# EAGLE design main (EAGLE 6.1)
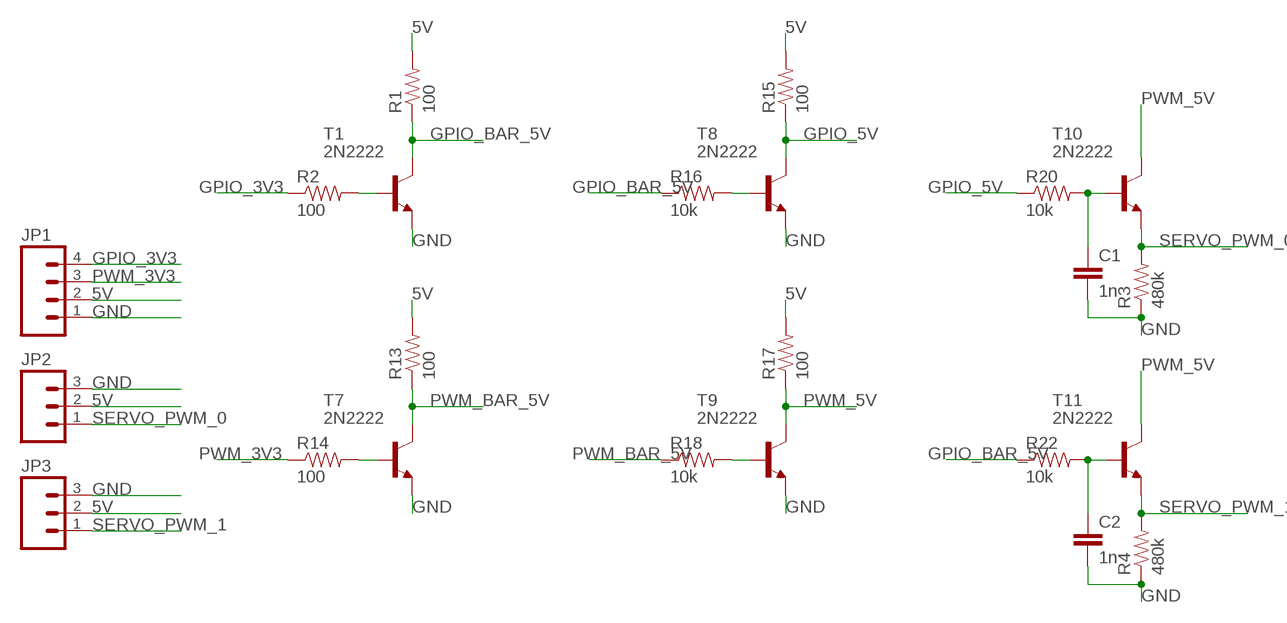
[diagram p0: schematic, sheet 1]

## Parts
C1  1n  CAPKIT  [CAP-PTH-SMALL-KIT]
C2  1n  CAPKIT  [CAP-PTH-SMALL-KIT]
JP1  M04LONGPADS  [1X04_LONGPADS]
JP2  M03LONGPADS  [1X03_LONGPADS]
JP3  M03LONGPADS  [1X03_LONGPADS]
R1  100  RESISTORPTH-1/4W  [AXIAL-0.4]
R2  100  RESISTORPTH-1/4W  [AXIAL-0.4]
R3  480k  RESISTORPTH-1/4W  [AXIAL-0.4]
R4  480k  RESISTORPTH-1/4W  [AXIAL-0.4]
R13  100  RESISTORPTH-1/4W  [AXIAL-0.4]
R14  100  RESISTORPTH-1/4W  [AXIAL-0.4]
R15  100  RESISTORPTH-1/4W  [AXIAL-0.4]
R16  10k  RESISTORPTH-1/4W  [AXIAL-0.4]
R17  100  RESISTORPTH-1/4W  [AXIAL-0.4]
R18  10k  RESISTORPTH-1/4W  [AXIAL-0.4]
R20  10k  RESISTORPTH-1/4W  [AXIAL-0.4]
R22  10k  RESISTORPTH-1/4W  [AXIAL-0.4]
T1  2N2222  [TO18]
T7  2N2222  [TO18]
T8  2N2222  [TO18]
T9  2N2222  [TO18]
T10  2N2222  [TO18]
T11  2N2222  [TO18]

## Nets
5V: JP1.2 JP2.2 JP3.2 R1.P$2 R13.P$2 R15.P$2 R17.P$2
GND: C1.2 C2.2 JP1.1 JP2.3 JP3.3 R3.P$1 R4.P$1 T1.1(E) T7.1(E) T8.1(E) T9.1(E)
GPIO_3V3: JP1.4 R2.P$1
GPIO_5V: R15.P$1 R20.P$1 T8.3(C)
GPIO_BAR_5V: R1.P$1 R16.P$1 R22.P$1 T1.3(C)
N$1: R2.P$2 T1.2(B)
N$2: R14.P$2 T7.2(B)
N$3: R16.P$2 T8.2(B)
N$4: R18.P$2 T9.2(B)
N$5: C1.1 R20.P$2 T10.2(B)
N$6: C2.1 R22.P$2 T11.2(B)
PWM_3V3: JP1.3 R14.P$1
PWM_5V: R17.P$1 T9.3(C) T10.3(C) T11.3(C)
PWM_BAR_5V: R13.P$1 R18.P$1 T7.3(C)
SERVO_PWM_0: JP2.1 R3.P$2 T10.1(E)
SERVO_PWM_1: JP3.1 R4.P$2 T11.1(E)

## Library data of the parts
C1 C2 = SparkFun:CAP: Capacitor Standard 0603 ceramic capacitor, and 0.1" leaded capacitor.
JP1 = SparkFun:M04: Header 4 Standard 4-pin 0.1" header. Use with straight break away headers (SKU : PRT-00116), right angle break away headers (PRT-00553), swiss pins (PRT-00743), machine pins (PRT-00117), and female headers (PRT-00115). Molex polarized connector foot print use with SKU : PRT-08231 with associated crimp pins and housings. 1MM SMD Version SKU: PRT-10208
JP2 JP3 = SparkFun:M03: Header 3 Standard 3-pin 0.1" header. Use with straight break away headers (SKU : PRT-00116), right angle break away headers (PRT-00553), swiss pins (PRT-00743), machine pins (PRT-00117), and female headers (PRT-00115). Molex polarized connector foot print use with SKU : PRT-08232 with associated crimp pins and housings.
R1-R4 R13-R18 R20 R22 = SparkFun:RESISTOR: Resistor Basic schematic elements and footprints for 0603, 1206, and PTH resistors.
T1 T7-T11 = transistor:2N2222: NPN TRANSISTOR

## Board
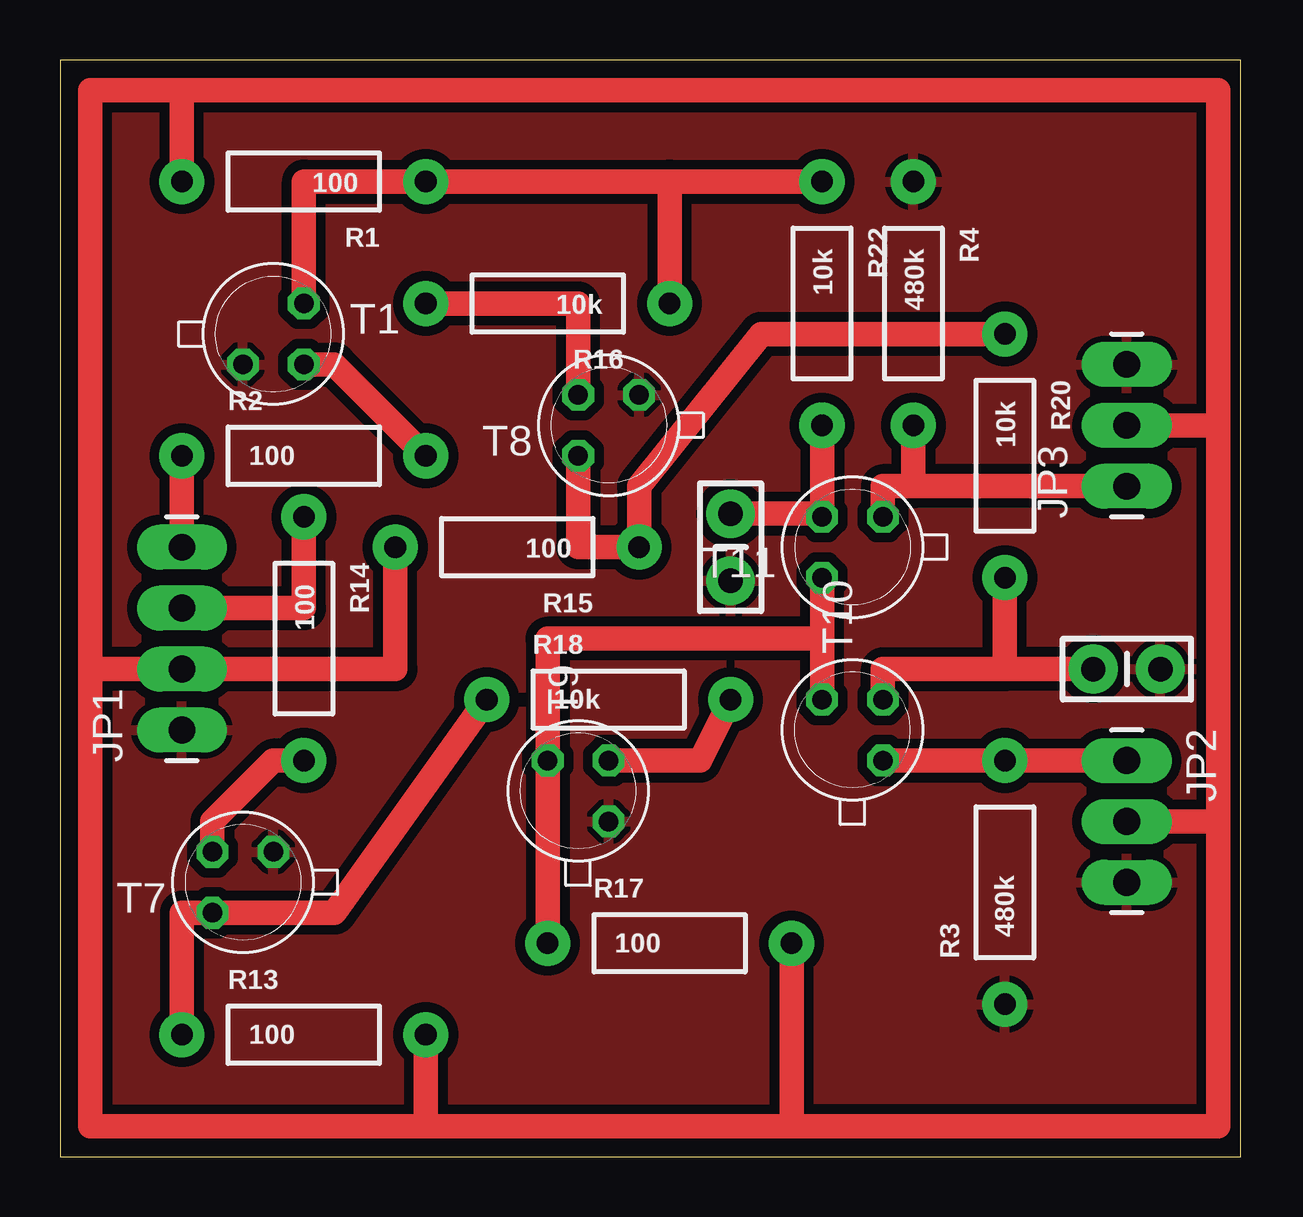
[diagram p1: board, top side]

Size 49.2 x 45.71 mm. Coordinates in mm from the lower left corner, seen from the top.
Outline: 0,0 49.2,0 49.2,45.71 0,45.71 0,0
Copper layers (1*16): Top 0.035mm / dielectric 1.5mm / Bottom 0.035mm
Design rules: minimum track width 10mil, minimum drill 24mil, track to track 8mil, track to pad 8mil, pad to pad 8mil, via to via 8mil, smd to smd 8mil, copper to edge 40mil, drill to drill 8mil, minimum pad ring 10mil, minimum via ring 8mil, stop-mask expansion 4mil, vias tented up to drill 0mil, thermal gap 10mil

### Footprints (pad centres in the part's own frame; a part is rotated, then mirrored left to right if it is on the bottom)
CAP-PTH-SMALL-KIT = drill 1.016 pad 2.032: 1 -1.397,0; 2 1.397,0
1X04_LONGPADS = drill 1.118 pad 1.88 long: 1 0,0; 2 2.54,0; 3 5.08,0; 4 7.62,0
1X03_LONGPADS = drill 1.118 pad 1.88 long: 1 0,0; 2 2.54,0; 3 5.08,0
AXIAL-0.4 = drill 0.9 pad 1.88: P$1 -5.08,0; P$2 5.08,0
TO18 = drill 0.813 octagon: 1 -1.27,-1.27; 2 1.27,-1.27; 3 1.27,1.27

### Placement (x,y rotation side)
C1  44.45,20.32 0 top
C2  27.94,25.4 270 top
JP1  5.08,17.78 90 top
JP2  44.45,16.51 270 top
JP3  44.45,27.94 90 top
R1  10.16,40.64 180 top
R2  10.16,29.21 0 top
R3  39.37,11.43 90 top
R4  35.56,35.56 270 top
R13  10.16,5.08 0 top
R14  10.16,21.59 270 top
R15  19.05,25.4 180 top
R16  20.32,35.56 180 top
R17  25.4,8.89 0 top
R18  22.86,19.05 0 top
R20  39.37,29.21 270 top
R22  31.75,35.56 270 top
T1  8.89,34.29 0 top
T7  7.62,11.43 180 top
T8  22.86,30.48 180 top
T9  21.59,15.24 90 top
T10  33.02,17.78 90 top
T11  33.02,25.4 180 top

### Tracks (layer width: path | path; a pad name or v marks a point on that pad's centre or on a via)
5V
  Top 1.016: JP3.2 48.26,30.48 | JP2.2 48.26,13.97 | 48.26,13.97 48.26,1.27 30.48,1.27 | 30.48,1.27 R17.P$2 | 1.27,20.32 1.27,1.27 15.24,1.27 | 15.24,1.27 30.48,1.27 | 1.27,20.32 JP1.2 13.97,20.32 R15.P$2 | 1.27,20.32 1.27,44.45 5.08,44.45 | 5.08,44.45 48.26,44.45 48.26,30.48 | R1.P$2 5.08,44.45 | R13.P$2 15.24,1.27 | 48.26,30.48 48.26,13.97
GND
  pour Top (isolate 0.406): 0,45.72 49.53,45.72 49.53,0 0,0
GPIO_3V3
  Top 1.016: JP1.4 R2.P$1
GPIO_5V
  Top 1.016: T8.3 21.59,25.4 R15.P$1 24.13,27.94 29.21,34.29 R20.P$1
GPIO_BAR_5V
  Top 1.016: T1.3 10.16,40.64 R1.P$1 25.4,40.64 | 25.4,40.64 R22.P$1 | R16.P$1 25.4,40.64
N$1
  Top 1.016: T1.2 11.43,33.02 R2.P$2
N$2
  Top 1.016: R14.P$2 8.89,16.51 6.35,13.97 T7.2
N$3
  Top 1.016: T8.2 21.59,35.56 R16.P$2
N$4
  Top 1.016: T9.2 26.67,16.51 R18.P$2
N$5
  Top 1.016: T10.2 34.29,20.32 39.37,20.32 | 39.37,20.32 R20.P$2 | C1.1 39.37,20.32
N$6
  Top 1.016: R22.P$2 T11.2 31.75,26.8 C2.1
PWM_3V3
  Top 1.016: JP1.3 10.16,22.86 R14.P$1
PWM_5V
  Top 1.016: R17.P$1 T9.3 20.32,21.59 31.75,21.59 | 31.75,21.59 T11.3 | T10.3 31.75,21.59
PWM_BAR_5V
  Top 1.016: R13.P$1 5.08,10.16 T7.3 11.43,10.16 R18.P$1
SERVO_PWM_0
  Top 1.016: T10.1 R3.P$2 JP2.1
SERVO_PWM_1
  Top 1.016: JP3.1 35.56,27.94 | 35.56,27.94 34.29,27.94 T11.1 | R4.P$2 35.56,27.94